# EAGLE design h-bridge-relay (EAGLE 8.0.0)
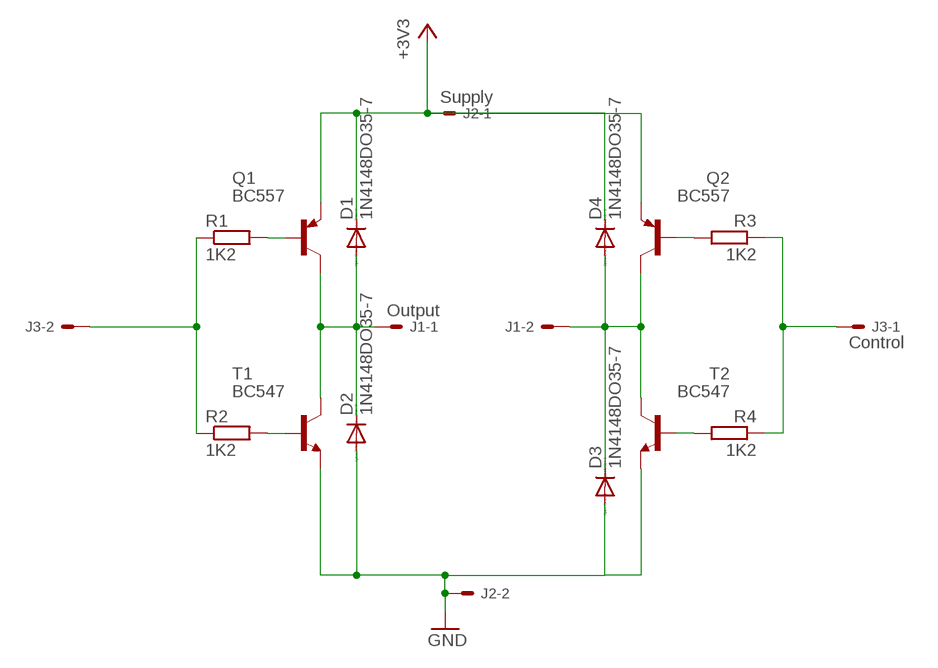
[diagram p0: schematic, sheet 1]

## Parts
D1  1N4148DO35-7  [DO35-7]
D2  1N4148DO35-7  [DO35-7]
D3  1N4148DO35-7  [DO35-7]
D4  1N4148DO35-7  [DO35-7]
J1  Output  22-27-2021-02  [6410-02]
J2  Supply  22-27-2021-02  [6410-02]
J3  Control  22-27-2021-02  [6410-02]
Q1  BC557  [TO92]
Q2  BC557  [TO92]
R1  1K2  R-EU_0207/7  [0207/7]
R2  1K2  R-EU_0207/12  [0207/12]
R3  1K2  R-EU_0207/2V  [0207/2V]
R4  1K2  R-EU_0207/7  [0207/7]
T1  BC547  [TO92]
T2  BC547  [TO92]

## Nets
+3V3: D1.C D4.C J2.1 Q1.1(E) Q2.1(E)
GND: D2.A D3.A J2.2 T1.1(E) T2.1(E)
N$1: R2.2 T1.2(B)
N$2: Q1.2(B) R1.2
N$3: Q2.2(B) R3.2
N$4: R4.2 T2.2(B)
N$5: D1.A D2.C J1.1 Q1.3(C) T1.3(C)
N$6: D3.C D4.A J1.2 Q2.3(C) T2.3(C)
N$7: J3.1 R3.1 R4.1
N$10: J3.2 R1.1 R2.1

## Library data of the parts
D1-D4 = diode:1N4148: DIODE high speed (Philips)
J1-J3 = con-molex:22-?-02: CONNECTOR wire to board 2.54 mm (.1 inch) pitch header; OC_FARNELL: unknown; OC_NEWARK: unknown
Q1 Q2 = transistor-pnp:BC557: PNP Transistor
R1-R4 = rcl:R-EU_: RESISTOR, European symbol
T1 T2 = transistor:BC547: NPN TRANSISTOR

## Board
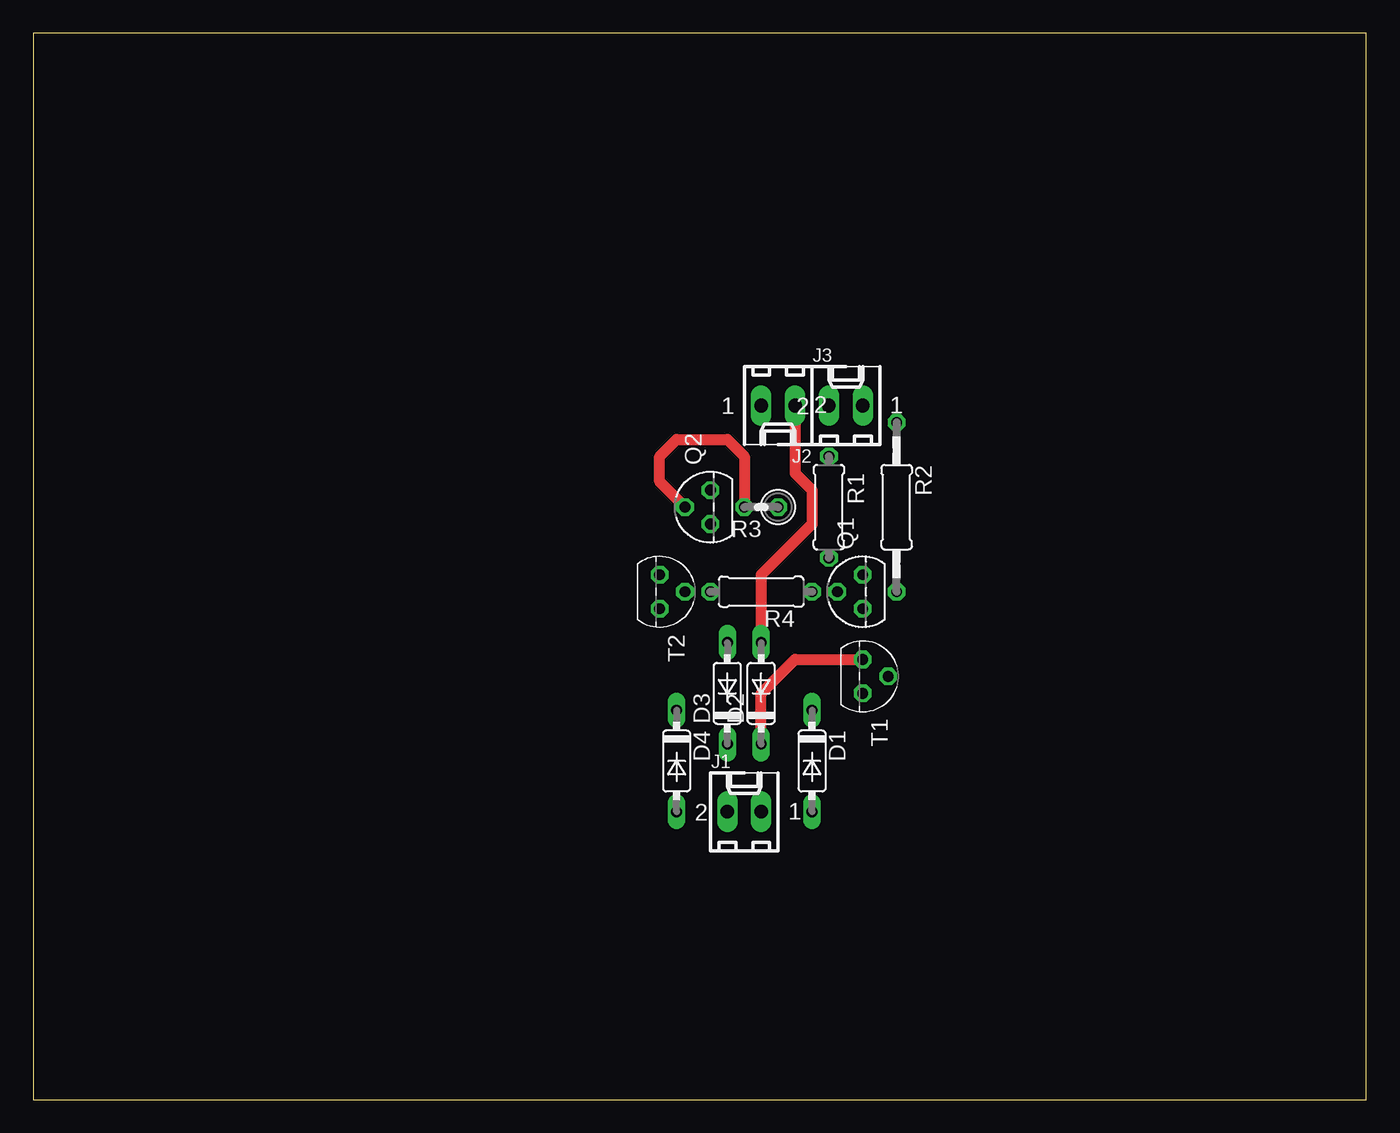
[diagram p1: board, top side]
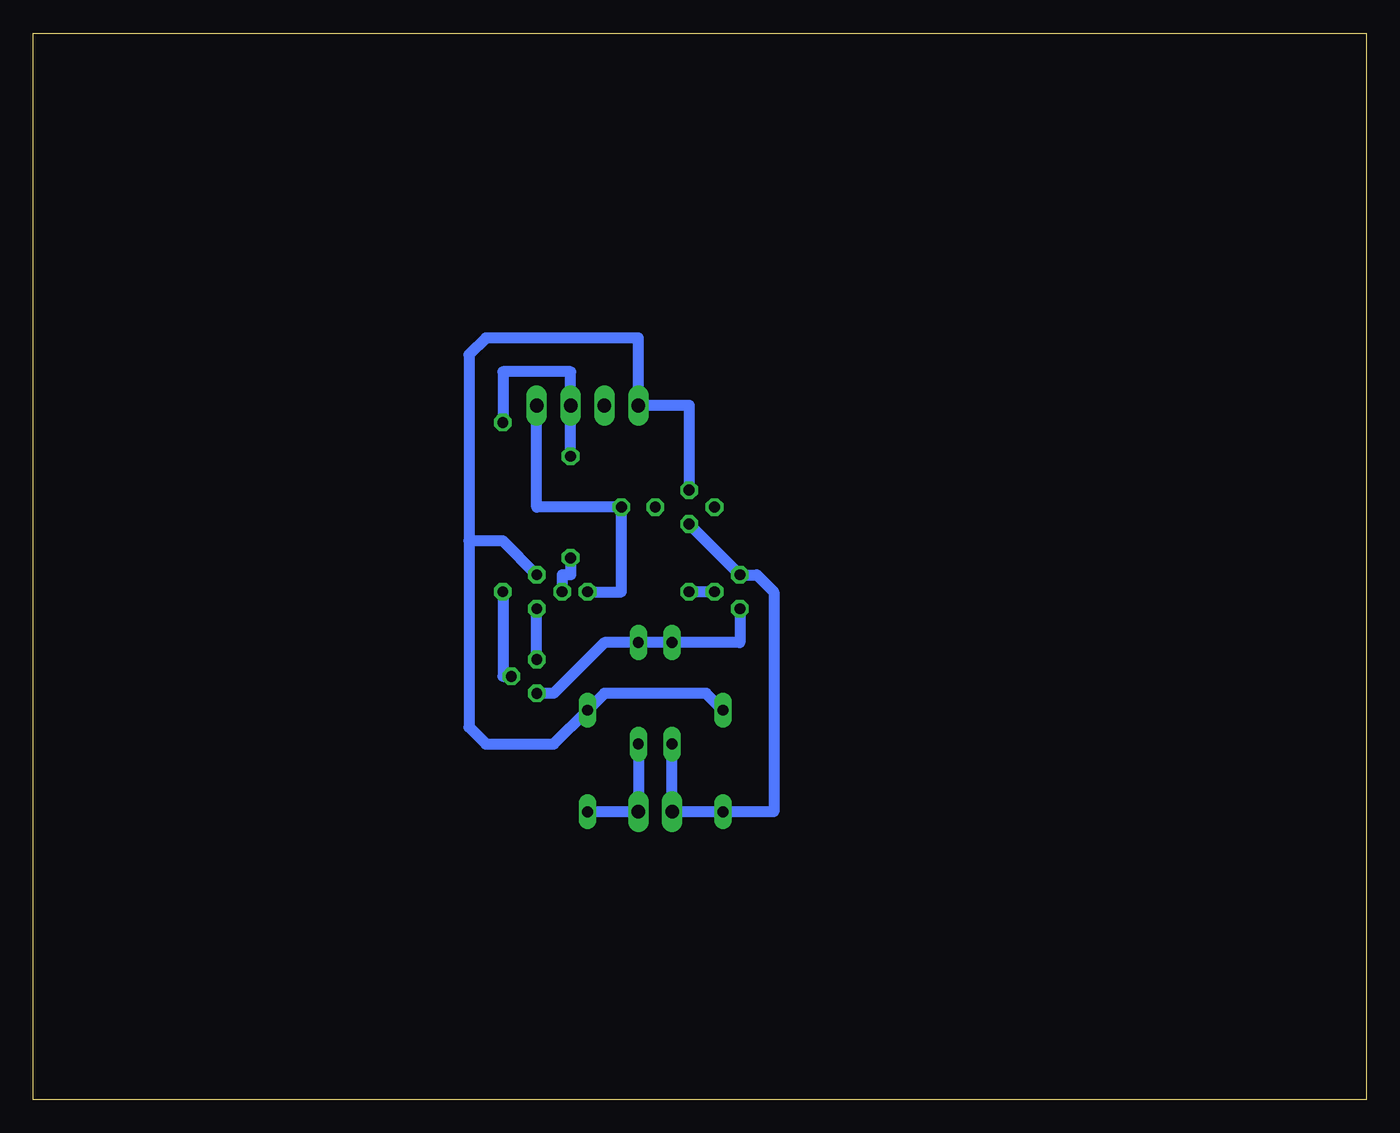
[diagram p2: board, bottom side, seen from below]

Size 100 x 80 mm. Coordinates in mm from the lower left corner, seen from the top.
Outline: 0,0 100,0 100,80 0,80 0,0
Copper layers (1*16): Top 0.035mm / dielectric 1.5mm / Bottom 0.035mm
Design rules "default": minimum track width 10mil, minimum drill 24mil, track to track 8mil, track to pad 8mil, pad to pad 8mil, via to via 8mil, smd to smd 8mil, copper to edge 40mil, drill to drill 8mil, minimum pad ring 10mil, minimum via ring 8mil, stop-mask expansion 4mil, vias tented up to drill 0mil, thermal gap 10mil

### Footprints (pad centres in the part's own frame; a part is rotated, then mirrored left to right if it is on the bottom)
DO35-7 = drill 0.813 long: A 3.81,0; C -3.81,0
6410-02 = drill 1.016 long: 1 1.27,0; 2 -1.27,0
TO92 = drill 0.813 octagon: 1 1.27,0; 2 0,1.905; 3 -1.27,0
0207/7 = drill 0.813 octagon: 1 -3.81,0; 2 3.81,0
0207/12 = drill 0.813 octagon: 1 -6.35,0; 2 6.35,0
0207/2V = drill 0.813 octagon: 1 -1.27,0; 2 1.27,0

### Placement (x,y rotation side)
D1  58.42,25.4 270 top
D2  54.61,30.48 90 top
D3  52.07,30.48 90 top
D4  48.26,25.4 270 top
J1  53.34,21.59 0 top
J2  55.88,52.07 180 top
J3  60.96,52.07 0 top
Q1  62.23,38.1 90 top
Q2  50.8,44.45 90 top
R1  59.69,44.45 270 top
R2  64.77,44.45 270 top
R3  54.61,44.45 180 top
R4  54.61,38.1 180 top
T1  62.23,31.75 270 top
T2  46.99,38.1 270 top

### Tracks (layer width: path | path; a pad name or v marks a point on that pad's centre or on a via)
+3V3
  Bottom 0.813: D4.C 49.53,30.48 57.15,30.48 D1.C 60.96,26.67 66.04,26.67 67.31,27.94 67.31,41.91 | Q1.1 64.77,41.91 67.31,41.91 | Q2.1 50.8,52.07 J2.1 54.61,57.15 66.04,57.15 67.31,55.88 67.31,41.91
GND
  Top 0.813: J2.2 57.15,46.99 58.42,45.72 58.42,43.18 54.61,39.37 D2.A
  Bottom 0.813: T2.1 46.99,34.29 D3.A D2.A 57.15,34.29 60.96,30.48 T1.1
N$1
  Bottom 0.813: R2.2 64.77,31.75 T1.2
N$2
  Bottom 0.813: R1.2 59.69,39.37 60.33,39.37 Q1.2
N$3
  Top 0.813: Q2.2 46.99,46.35 46.99,48.26 48.26,49.53 52.07,49.53 53.34,48.26 R3.2
N$4
  Bottom 0.813: T2.2 R4.2
N$5
  Top 0.813: D2.C 54.61,30.48 57.15,33.02 T1.3
  Bottom 0.813: D1.A J1.1 D2.C | T1.3 Q1.3
N$6
  Bottom 0.813: D3.C J1.2 D4.A 44.45,21.59 44.45,38.1 45.72,39.37 T2.3 Q2.3
N$7
  Bottom 0.813: J3.1 62.23,44.45 R3.1 55.88,38.1 R4.1
N$10
  Bottom 0.813: R1.1 J3.2 59.69,54.61 64.77,54.61 R2.1